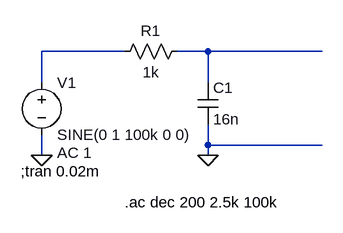
[diagram p0: schematic lab1RC.asc]
lab1RC.asc, the LTspice schematic file:
Version 4
SHEET 1 880 680
WIRE 80 128 -48 128
WIRE 208 128 160 128
WIRE 384 128 208 128
WIRE -48 176 -48 128
WIRE 208 176 208 128
WIRE 208 272 208 240
WIRE 384 272 208 272
WIRE -48 288 -48 256
WIRE 208 288 208 272
FLAG -48 288 0
FLAG 208 288 0
SYMBOL res 176 112 R90
WINDOW 0 0 56 VBottom 2
WINDOW 3 32 56 VTop 2
SYMATTR InstName R1
SYMATTR Value 1k
SYMBOL cap 192 176 R0
SYMATTR InstName C1
SYMATTR Value 16n
SYMBOL voltage -48 160 R0
WINDOW 123 24 124 Left 2
WINDOW 39 0 0 Left 2
SYMATTR Value2 AC 1
SYMATTR InstName V1
SYMATTR Value SINE(0 1 100k 0 0)
TEXT -80 312 Left 2 !;tran 0.02m
TEXT 80 360 Left 2 !.ac dec 200 2.5k 100k

The netlist it stands for:
* lab1RC.asc
R1 N002 N001 1k
C1 N002 0 16n
V1 N001 0 SINE(0 1 100k 0 0) AC 1
;tran 0.02m
.ac dec 200 2.5k 100k
.backanno
.end